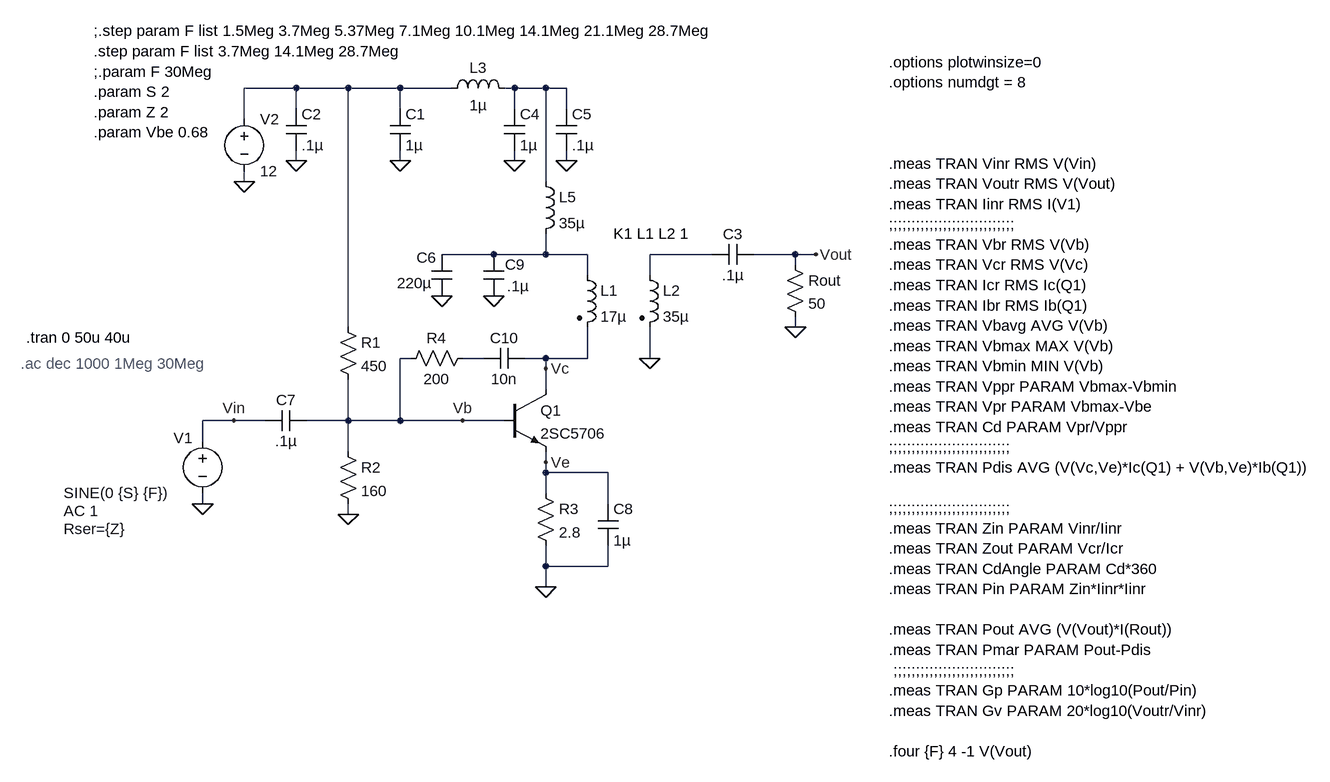
[diagram p0: schematic 2sc5706 5W.asc]
2sc5706 5W.asc, the LTspice schematic file:
Version 4
SHEET 1 2100 1496
WIRE 32 -320 -48 -320
WIRE 112 -320 32 -320
WIRE 192 -320 112 -320
WIRE 272 -320 192 -320
WIRE 368 -320 352 -320
WIRE 416 -320 368 -320
WIRE 448 -320 416 -320
WIRE 32 -288 32 -320
WIRE 192 -288 192 -320
WIRE 368 -288 368 -320
WIRE 448 -288 448 -320
WIRE -48 -272 -48 -320
WIRE 32 -208 32 -224
WIRE 192 -208 192 -224
WIRE 368 -208 368 -224
WIRE 448 -208 448 -224
WIRE -48 -176 -48 -192
WIRE 416 -176 416 -320
WIRE 336 -64 256 -64
WIRE 416 -64 416 -96
WIRE 416 -64 336 -64
WIRE 480 -64 416 -64
WIRE 672 -64 576 -64
WIRE 800 -64 736 -64
WIRE 832 -64 800 -64
WIRE 800 -48 800 -64
WIRE 480 -32 480 -64
WIRE 576 -32 576 -64
WIRE 112 48 112 -320
WIRE 800 48 800 32
WIRE 208 96 192 96
WIRE 320 96 288 96
WIRE 416 96 384 96
WIRE 480 96 480 48
WIRE 480 96 416 96
WIRE 576 96 576 48
WIRE 416 112 416 96
WIRE 416 144 416 112
WIRE -64 192 -112 192
WIRE -16 192 -64 192
WIRE 112 192 112 128
WIRE 112 192 48 192
WIRE 192 192 192 96
WIRE 192 192 112 192
WIRE 288 192 192 192
WIRE 352 192 288 192
WIRE -112 224 -112 192
WIRE 112 240 112 192
WIRE 416 256 416 240
WIRE 416 272 416 256
WIRE 512 272 416 272
WIRE 416 304 416 272
WIRE -112 320 -112 304
WIRE 512 320 512 272
WIRE 112 336 112 320
WIRE 416 416 416 384
WIRE 512 416 512 384
WIRE 512 416 416 416
WIRE 416 448 416 416
FLAG 192 -208 0
FLAG 32 -208 0
FLAG -48 -176 0
FLAG -112 320 0
FLAG 416 448 0
FLAG 832 -64 Vout
FLAG 800 48 0
FLAG 368 -208 0
FLAG 448 -208 0
FLAG 288 192 Vb
FLAG 416 256 Ve
FLAG -64 192 Vin
FLAG 416 112 Vc
FLAG 112 336 0
FLAG 336 0 0
FLAG 256 0 0
FLAG 576 96 0
SYMBOL npn 352 144 R0
SYMATTR InstName Q1
SYMATTR Value 2SC5706
SYMBOL voltage -112 208 R0
WINDOW 0 -45 11 Left 2
WINDOW 3 -214 95 Left 2
WINDOW 123 -214 123 Left 2
WINDOW 39 -214 151 Left 2
SYMATTR InstName V1
SYMATTR Value SINE(0 {S} {F})
SYMATTR Value2 AC 1
SYMATTR SpiceLine Rser={Z}
SYMBOL voltage -48 -288 R0
WINDOW 123 0 0 Left 0
WINDOW 39 0 0 Left 0
SYMATTR InstName V2
SYMATTR Value 12
SYMBOL res 96 32 R0
SYMATTR InstName R1
SYMATTR Value 450
SYMBOL cap 176 -288 R0
SYMATTR InstName C1
SYMATTR Value 1µ
SYMBOL cap 16 -288 R0
SYMATTR InstName C2
SYMATTR Value .1µ
SYMBOL cap 736 -80 R90
WINDOW 0 0 32 VBottom 2
WINDOW 3 32 32 VTop 2
SYMATTR InstName C3
SYMATTR Value .1µ
SYMBOL ind2 464 -48 R0
SYMATTR InstName L1
SYMATTR Value 17µ
SYMATTR Type ind
SYMBOL res 784 -64 R0
SYMATTR InstName Rout
SYMATTR Value 50
SYMBOL ind 256 -304 R270
WINDOW 0 32 56 VTop 2
WINDOW 3 5 56 VBottom 2
SYMATTR InstName L3
SYMATTR Value 1µ
SYMBOL cap 352 -288 R0
SYMATTR InstName C4
SYMATTR Value 1µ
SYMBOL cap 432 -288 R0
SYMATTR InstName C5
SYMATTR Value .1µ
SYMBOL cap 48 176 R90
WINDOW 0 0 32 VBottom 2
WINDOW 3 32 32 VTop 2
SYMATTR InstName C7
SYMATTR Value .1µ
SYMBOL ind2 560 -48 R0
SYMATTR InstName L2
SYMATTR Value 35µ
SYMATTR Type ind
SYMBOL res 400 288 R0
SYMATTR InstName R3
SYMATTR Value 2.8
SYMBOL res 96 224 R0
SYMATTR InstName R2
SYMATTR Value 160
SYMBOL cap 496 320 R0
SYMATTR InstName C8
SYMATTR Value 1µ
SYMBOL ind 400 -192 R0
SYMATTR InstName L5
SYMATTR Value 35µ
SYMBOL cap 320 -64 R0
WINDOW 0 33 16 Left 2
WINDOW 3 36 49 Left 2
SYMATTR InstName C9
SYMATTR Value .1µ
SYMBOL cap 240 -64 R0
WINDOW 0 -23 5 Left 2
WINDOW 3 -53 44 Left 2
SYMATTR InstName C6
SYMATTR Value 220µ
SYMBOL cap 384 80 R90
WINDOW 0 0 32 VBottom 2
WINDOW 3 32 32 VTop 2
SYMATTR InstName C10
SYMATTR Value 10n
SYMBOL res 304 80 R90
WINDOW 0 0 56 VBottom 2
WINDOW 3 32 56 VTop 2
SYMATTR InstName R4
SYMATTR Value 200
TEXT -384 64 Left 2 !.tran 0 50u 40u
TEXT 944 -360 Left 2 !.options plotwinsize=0\n.options numdgt = 8\n \n \n \n.meas TRAN Vinr RMS V(Vin)\n.meas TRAN Voutr RMS V(Vout)\n.meas TRAN Iinr RMS I(V1)\n;;;;;;;;;;;;;;;;;;;;;;;;;;;;\n.meas TRAN Vbr RMS V(Vb)\n.meas TRAN Vcr RMS V(Vc)\n.meas TRAN Icr RMS Ic(Q1)\n.meas TRAN Ibr RMS Ib(Q1)\n.meas TRAN Vbavg AVG V(Vb)\n.meas TRAN Vbmax MAX V(Vb)\n.meas TRAN Vbmin MIN V(Vb)\n.meas TRAN Vppr PARAM Vbmax-Vbmin\n.meas TRAN Vpr PARAM Vbmax-Vbe\n.meas TRAN Cd PARAM Vpr/Vppr\n;;;;;;;;;;;;;;;;;;;;;;;;;;;\n.meas TRAN Pdis AVG (V(Vc,Ve)*Ic(Q1) + V(Vb,Ve)*Ib(Q1))\n \n;;;;;;;;;;;;;;;;;;;;;;;;;;;\n.meas TRAN Zin PARAM Vinr/Iinr\n.meas TRAN Zout PARAM Vcr/Icr\n.meas TRAN CdAngle PARAM Cd*360\n.meas TRAN Pin PARAM Zin*Iinr*Iinr\n \n.meas TRAN Pout AVG (V(Vout)*I(Rout))\n.meas TRAN Pmar PARAM Pout-Pdis\n ;;;;;;;;;;;;;;;;;;;;;;;;;;;\n.meas TRAN Gp PARAM 10*log10(Pout/Pin)\n.meas TRAN Gv PARAM 20*log10(Voutr/Vinr)\n \n.four {F} 4 -1 V(Vout)
TEXT -280 -408 Left 2 !;.step param F list 1.5Meg 3.7Meg 5.37Meg 7.1Meg 10.1Meg 14.1Meg 21.1Meg 28.7Meg\n.step param F list 3.7Meg 14.1Meg 28.7Meg\n;.param F 30Meg\n.param S 2\n.param Z 2\n.param Vbe 0.68
TEXT 520 -96 Left 2 !K1 L1 L2 1
TEXT -392 104 Left 2 ;.ac dec 1000 1Meg 30Meg

The netlist it stands for:
* 2sc5706 5W.asc
Q1 Vc Vb Ve 0 2SC5706
V1 Vin 0 SINE(0 {S} {F}) AC 1 Rser={Z}
V2 N001 0 12
R1 N001 Vb 450
C1 N001 0 1µ
C2 N001 0 .1µ
C3 Vout N004 .1µ
L1 N003 Vc 17µ
Rout Vout 0 50
L3 N001 N002 1µ
C4 N002 0 1µ
C5 N002 0 .1µ
C7 Vb Vin .1µ
L2 N004 0 35µ
R3 Ve 0 2.8
R2 Vb 0 160
C8 Ve 0 1µ
L5 N002 N003 35µ
C9 N003 0 .1µ
C6 N003 0 220µ
C10 Vc N005 10n
R4 N005 Vb 200
.model NPN NPN
.model PNP PNP
.lib standard.bjt
.tran 0 50u 40u
.options plotwinsize=0
.options numdgt = 8
.meas TRAN Vinr RMS V(Vin)
.meas TRAN Voutr RMS V(Vout)
.meas TRAN Iinr RMS I(V1)
;;;;;;;;;;;;;;;;;;;;;;;;;;;;
.meas TRAN Vbr RMS V(Vb)
.meas TRAN Vcr RMS V(Vc)
.meas TRAN Icr RMS Ic(Q1)
.meas TRAN Ibr RMS Ib(Q1)
.meas TRAN Vbavg AVG V(Vb)
.meas TRAN Vbmax MAX V(Vb)
.meas TRAN Vbmin MIN V(Vb)
.meas TRAN Vppr PARAM Vbmax-Vbmin
.meas TRAN Vpr PARAM Vbmax-Vbe
.meas TRAN Cd PARAM Vpr/Vppr
;;;;;;;;;;;;;;;;;;;;;;;;;;;
.meas TRAN Pdis AVG (V(Vc,Ve)*Ic(Q1) + V(Vb,Ve)*Ib(Q1))
;;;;;;;;;;;;;;;;;;;;;;;;;;;
.meas TRAN Zin PARAM Vinr/Iinr
.meas TRAN Zout PARAM Vcr/Icr
.meas TRAN CdAngle PARAM Cd*360
.meas TRAN Pin PARAM Zin*Iinr*Iinr
.meas TRAN Pout AVG (V(Vout)*I(Rout))
.meas TRAN Pmar PARAM Pout-Pdis
 ;;;;;;;;;;;;;;;;;;;;;;;;;;;
.meas TRAN Gp PARAM 10*log10(Pout/Pin)
.meas TRAN Gv PARAM 20*log10(Voutr/Vinr)
.four {F} 4 -1 V(Vout)
;.step param F list 1.5Meg 3.7Meg 5.37Meg 7.1Meg 10.1Meg 14.1Meg 21.1Meg 28.7Meg
.step param F list 3.7Meg 14.1Meg 28.7Meg
;.param F 30Meg
.param S 2
.param Z 2
.param Vbe 0.68
K1 L1 L2 1
* .ac dec 1000 1Meg 30Meg
.backanno
.end